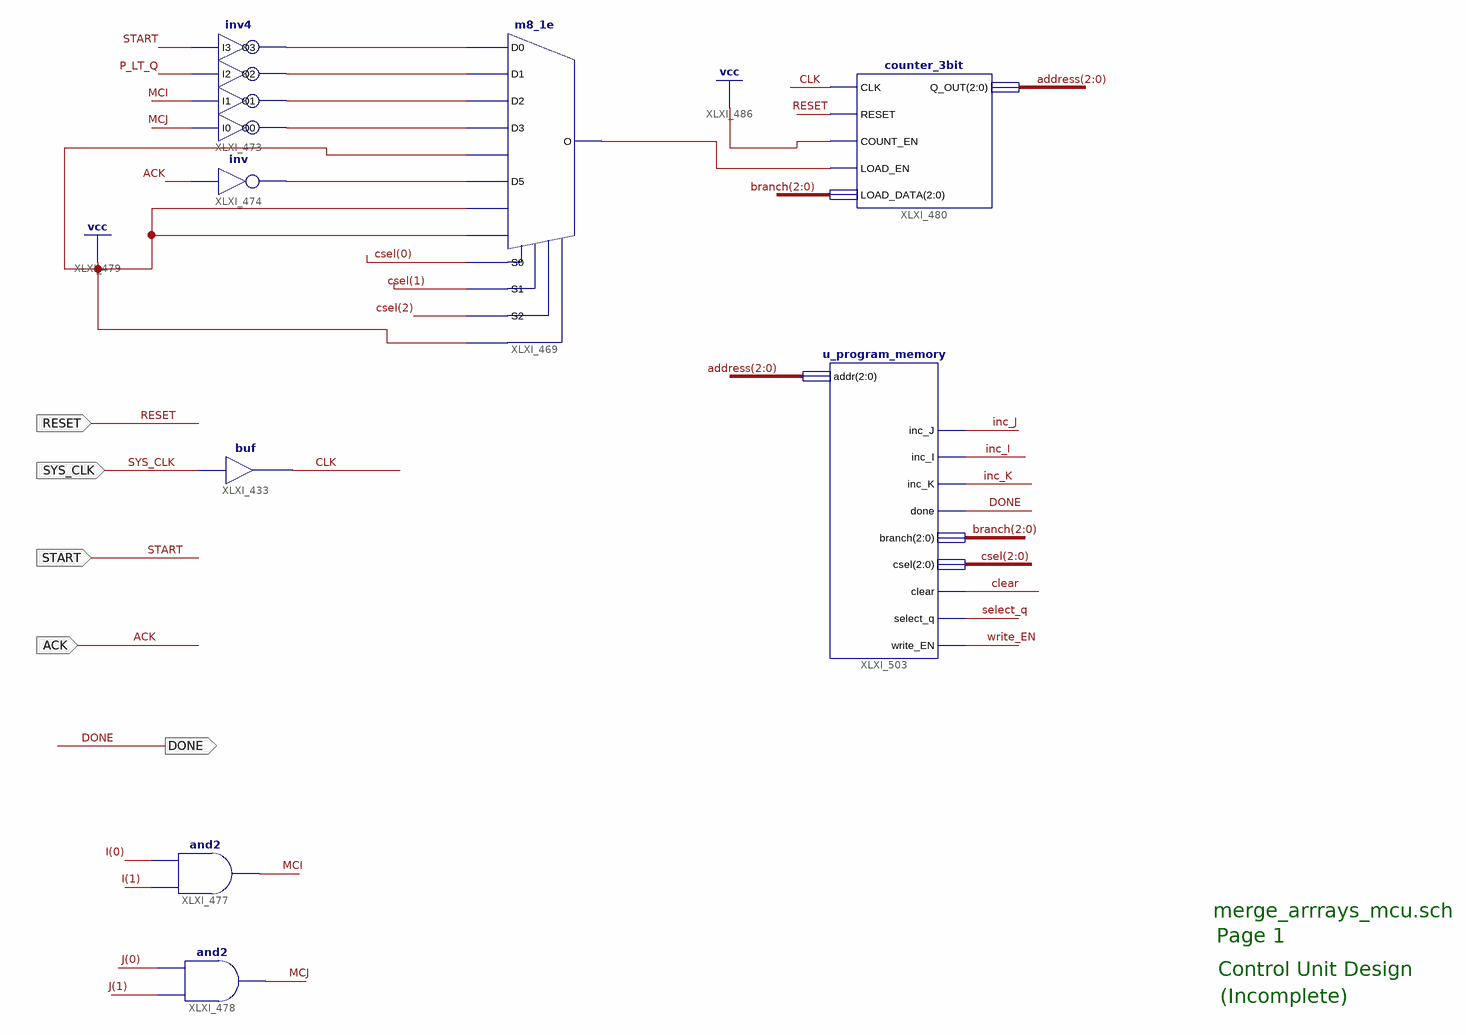
[diagram p0: schematic sheet 1]
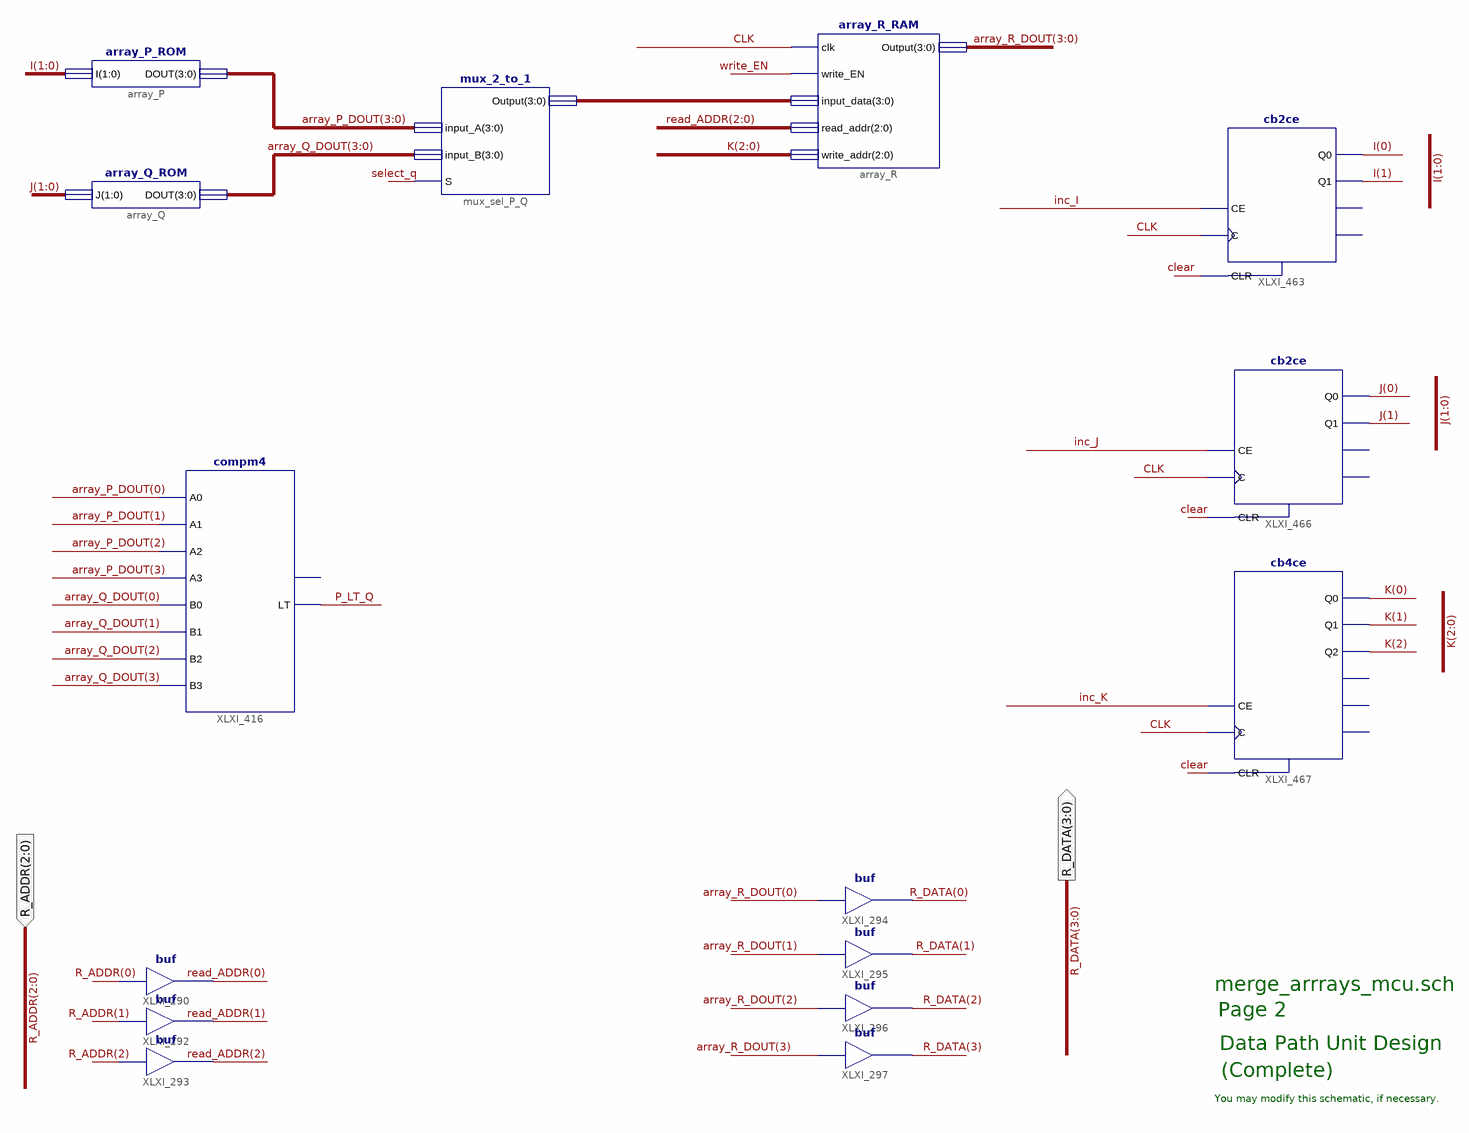
[diagram p1: schematic sheet 2]
// Xilinx ISE schematic merge_arrays_mcu.sch (spartan6) as structural Verilog: 23 symbols, 7 ports
module merge_arrays_mcu (
  input  ACK,
  input  RESET,
  input  SYS_CLK,
  input  START,
  input  [2:0] R_ADDR,
  output [3:0] R_DATA,
  output DONE
);

  wire clear, CLK, inc_I, inc_J, inc_K, MCI, MCJ, P_LT_Q, select_q, write_EN, XLXN_809, XLXN_810, XLXN_811,
       XLXN_812, XLXN_814, XLXN_860;
  wire [1:0] I, J;
  wire [2:0] address, branch, csel, K, read_ADDR;
  wire [3:0] array_P_DOUT, array_Q_DOUT, array_R_DOUT, XLXN_149;

  array_P_ROM array_P (.I(I), .DOUT(array_P_DOUT));
  array_Q_ROM array_Q (.J(J), .DOUT(array_Q_DOUT));
  mux_2_to_1 mux_sel_P_Q (.input_A(array_P_DOUT), .input_B(array_Q_DOUT), .Output(XLXN_149), .S(select_q));
  array_R_RAM array_R (
    .clk(CLK), .write_EN(write_EN), .input_data(XLXN_149), .read_addr(read_ADDR), .write_addr(K),
    .Output(array_R_DOUT));
  buf XLXI_294 (R_DATA[0], array_R_DOUT[0]);
  buf XLXI_295 (R_DATA[1], array_R_DOUT[1]);
  buf XLXI_296 (R_DATA[2], array_R_DOUT[2]);
  buf XLXI_297 (R_DATA[3], array_R_DOUT[3]);
  compm4 XLXI_416 (
    .A0(array_P_DOUT[0]), .A1(array_P_DOUT[1]), .A2(array_P_DOUT[2]), .A3(array_P_DOUT[3]),
    .B0(array_Q_DOUT[0]), .B1(array_Q_DOUT[1]), .B2(array_Q_DOUT[2]), .B3(array_Q_DOUT[3]), .LT(P_LT_Q));  // open: GT
  buf XLXI_290 (read_ADDR[0], R_ADDR[0]);
  buf XLXI_292 (read_ADDR[1], R_ADDR[1]);
  buf XLXI_293 (read_ADDR[2], R_ADDR[2]);
  buf XLXI_433 (CLK, SYS_CLK);
  cb2ce XLXI_466 (.C(CLK), .CE(inc_J), .CLR(clear), .Q0(J[0]), .Q1(J[1]));  // open: CEO, TC
  cb4ce XLXI_467 (.C(CLK), .CE(inc_K), .CLR(clear), .Q0(K[0]), .Q1(K[1]), .Q2(K[2]));  // open: CEO, Q3, TC
  m8_1e XLXI_469 (
    .D0(XLXN_809), .D1(XLXN_810), .D2(XLXN_811), .D3(XLXN_812), .D4(1'b1), .D5(XLXN_814), .D6(1'b1),
    .D7(1'b1), .E(1'b1), .S0(csel[0]), .S1(csel[1]), .S2(csel[2]), .O(XLXN_860));
  inv4 XLXI_473 (
    .I0(MCJ), .I1(MCI), .I2(P_LT_Q), .I3(START), .O0(XLXN_812), .O1(XLXN_811), .O2(XLXN_810), .O3(XLXN_809));
  not XLXI_474 (XLXN_814, ACK);
  and XLXI_477 (MCI, I[1], I[0]);
  and XLXI_478 (MCJ, J[1], J[0]);
  counter_3bit XLXI_480 (
    .CLK(CLK), .RESET(RESET), .COUNT_EN(1'b1), .LOAD_EN(XLXN_860), .LOAD_DATA(branch), .Q_OUT(address));
  cb2ce XLXI_463 (.C(CLK), .CE(inc_I), .CLR(clear), .Q0(I[0]), .Q1(I[1]));  // open: CEO, TC
  u_program_memory XLXI_503 (
    .addr(address), .done(DONE), .inc_I(inc_I), .inc_J(inc_J), .inc_K(inc_K), .clear(clear),
    .select_q(select_q), .write_EN(write_EN), .branch(branch), .csel(csel));

  // Notes on the sheet:
  //   merge_arrrays_mcu.sch
  //   Page 1
  //   Control Unit Design
  //   (Incomplete)
  //   merge_arrrays_mcu.sch
  //   Page 2
  //   Data Path Unit Design
  //   (Complete)
  //   You may modify this schematic, if necessary.
endmodule
